# Altium schematic sheet Comunicaciones.SchDoc
size A4
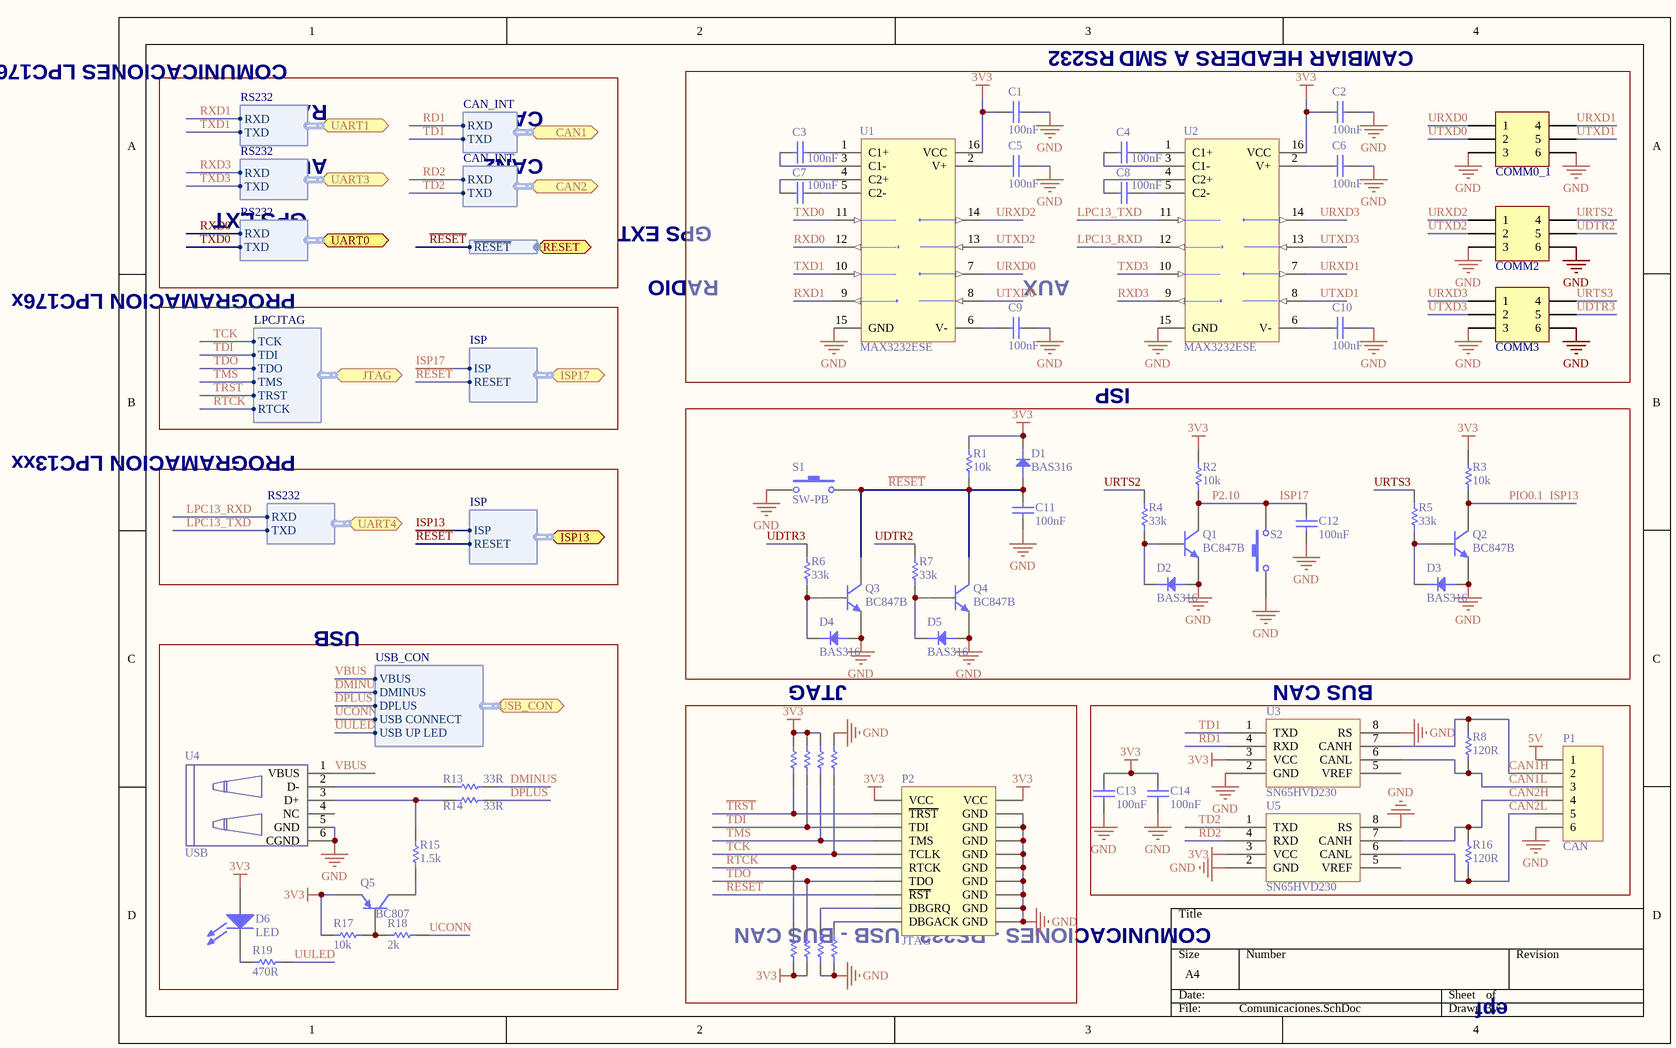
[diagram p0: Comunicaciones.SchDoc]

## Parts
C1  value 100nF  [CAP0402]  (hidden comment: Capacitor)
C2  value 100nF  [CAP0402]  (hidden comment: Capacitor)
C3  value 100nF  [CAP0402]  (hidden comment: Capacitor)
C4  value 100nF  [CAP0402]  (hidden comment: Capacitor)
C5  value 100nF  [CAP0402]  (hidden comment: Capacitor)
C6  value 100nF  [CAP0402]  (hidden comment: Capacitor)
C7  value 100nF  [CAP0402]  (hidden comment: Capacitor)
C8  value 100nF  [CAP0402]  (hidden comment: Capacitor)
C9  value 100nF  [CAP0402]  (hidden comment: Capacitor)
C10  value 100nF  [CAP0402]  (hidden comment: Capacitor)
C11  value 100nF  [CAP0402]  (hidden comment: Capacitor)
C12  value 100nF  [CAP0402]  (hidden comment: Capacitor)
C13  value 100nF  [CAP0402]  (hidden comment: Capacitor)
C14  value 100nF  [CAP0402]  (hidden comment: Capacitor)
COMM0_1  AP_COMM  [HDR2X3_CEN]  (value not drawn)
COMM2  AP_COMM  [HDR2X3_CEN]  (value not drawn)
COMM3  AP_COMM  [HDR2X3_CEN]  (value not drawn)
D1  BAS316  [SOD-323]
D2  BAS316  [SOD-323]
D3  BAS316  [SOD-323]
D4  BAS316  [SOD-323]
D5  BAS316  [SOD-323]
D6  LED  [PLCC-2Rojo]
P1  CAN  [HDR1X6]
P2  JTAG  [HDR2X10]
Q1  BC847B  [SOT23]
Q2  BC847B  [SOT23]
Q3  BC847B  [SOT23]
Q4  BC847B  [SOT23]
Q5  BC807  [SOT23]
R1  value 10k  [RES0402]  (hidden comment: Resistor)
R2  value 10k  [RES0402]  (hidden comment: Resistor)
R3  value 10k  [RES0402]  (hidden comment: Resistor)
R4  value 33k  [RES0402]  (hidden comment: Resistor)
R5  value 33k  [RES0402]  (hidden comment: Resistor)
R6  value 33k  [RES0402]  (hidden comment: Resistor)
R7  value 33k  [RES0402]  (hidden comment: Resistor)
R8  value 120R  [RES0402]  (hidden comment: Resistor)
R9  Resistor  [RES0402]  (value not drawn)
R10  Resistor  [RES0402]  (value not drawn)
R11  Resistor  [RES0402]  (value not drawn)
R12  Resistor  [RES0402]  (value not drawn)
R13  value 33R  [RES0402]  (hidden comment: Resistor)
R14  value 33R  [RES0402]  (hidden comment: Resistor)
R15  value 1.5k  [RES0402]  (hidden comment: Resistor)
R16  value 120R  [RES0402]  (hidden comment: Resistor)
R17  value 10k  [RES0402]  (hidden comment: Resistor)
R18  value 2k  [RES0402]  (hidden comment: Resistor)
R19  value 470R  [RES0402]  (hidden comment: Resistor)
R20  Resistor  [RES0402]  (value not drawn)
R21  Resistor  [RES0402]  (value not drawn)
R22  Resistor  [RES0402]  (value not drawn)
R23  Resistor  [RES0402]  (value not drawn)
S1  SW-PB  [SW-PB6mm - 2]
S2  SW-PB  [SW-PB6mm - 2]  (value not drawn)
U1  MAX3232ESE  [SOIC127P602-16BN]
U2  MAX3232ESE  [SOIC127P602-16BN]
U3  SN65HVD230  [SOIC127P600-8CN]
U4  USB  [USB/SM0.8-6H5]
U5  SN65HVD230  [SOIC127P600-8CN]

## Ports
CAN1 (harness CAN_INT), CAN2 (harness CAN_INT), ISP13 (harness ISP), ISP17 (harness ISP), JTAG (harness LPCJTAG), RESET (harness RESET), UART0 (harness RS232), UART1 (harness RS232), UART3 (harness RS232), UART4 (harness RS232), USB_CON (harness USB_CON)

## Harnesses
RS232: RXD, TXD
CAN_INT: RXD, TXD
LPCJTAG: TCK, TDI, TDO, TMS, TRST, RTCK
ISP: ISP, RESET
USB_CON: DMINUS, DPLUS, VBUS, USB CONNECT, USB UP LED
RESET: ~{RESET}

## Nets
3V3: C1.2 C2.2 C13.2 C14.2 D1.1(K) D6.1(A) P2.1(VCC) P2.2(VCC) Q5.2(E) R1.2 R2.2 R3.2 R9.1 R10.1 R11.1 R17.1 R20.2 R21.2 U1.16(VCC) U2.16(VCC) U3.3(VCC) U5.3(VCC)
5V: P1.1
GND: C1.1 C2.1 C5.1 C6.1 C9.1 C10.1 C11.2 C12.2 C13.1 C14.1 COMM0_1.3 COMM0_1.6 COMM2.3 COMM2.6 COMM3.3 COMM3.6 D2.2(A) D3.2(A) D4.2(A) D5.2(A) P1.6 P2.4(GND) P2.6(GND) P2.8(GND) P2.10(GND) P2.12(GND) P2.14(GND) P2.16(GND) P2.18(GND) P2.20(GND) Q1.2(E) Q2.2(E) Q3.2(E) Q4.2(E) R12.1 R22.2 R23.2 S1.1 S2.1 U1.15(GND) U2.15(GND) U3.2(GND) U3.8(RS) U4.5(GND) U4.6(CGND) U5.2(GND) U5.8(RS)
~{RESET}: C11.1 D1.2(A) P2.15(~{RST}) Q3.3(C) Q4.3(C) R1.1 S1.2 ; port ISP17.RESET, port ISP13.RESET, port RESET.~{RESET}
~{TRST}: P2.3(~{TRST}) R9.2 ; port JTAG.TRST
CAN1H: P1.2 R8.1 U3.7(CANH)
CAN1L: P1.3 R8.2 U3.6(CANL)
CAN2H: P1.4 R16.1 U5.7(CANH)
CAN2L: P1.5 R16.2 U5.6(CANL)
DMINUS: R13.2 ; port USB_CON.DMINUS
DPLUS: R14.2 ; port USB_CON.DPLUS
ISP13: Q2.3(C) R3.1 ; port ISP13.ISP  [also labelled PIO0.1]
ISP17: C12.1 Q1.3(C) R2.1 S2.2 ; port ISP17.ISP  [also labelled P2.10]
LPC13_RXD: U2.12(R1OUT) ; port UART4.RXD
LPC13_TXD: U2.11(T1IN) ; port UART4.TXD
RD1: U3.4(RXD) ; port CAN1.RXD
RD2: U5.4(RXD) ; port CAN2.RXD
RTCK: P2.11(RTCK) R20.1 ; port JTAG.RTCK
RXD0: U1.12(R1OUT) ; port UART0.RXD
RXD1: U1.9(R2OUT) ; port UART1.RXD
RXD3: U2.9(R2OUT) ; port UART3.RXD
TCK: P2.9(TCLK) R12.2 ; port JTAG.TCK
TD1: U3.1(TXD) ; port CAN1.TXD
TD2: U5.1(TXD) ; port CAN2.TXD
TDI: P2.5(TDI) R10.2 ; port JTAG.TDI
TDO: P2.13(TDO) R21.1 ; port JTAG.TDO
TMS: P2.7(TMS) R11.2 ; port JTAG.TMS
TXD0: U1.11(T1IN) ; port UART0.TXD
TXD1: U1.10(T2IN) ; port UART1.TXD
TXD3: U2.10(T2IN) ; port UART3.TXD
UCONN: R18.2 ; port USB_CON.USB CONNECT
UDTR2: COMM2.5 R7.2
UDTR3: COMM3.5 R6.2
URTS2: COMM2.4 R4.2
URTS3: COMM3.4 R5.2
URXD0: COMM0_1.1 U1.7(T2OUT)
URXD1: COMM0_1.4 U2.7(T2OUT)
URXD2: COMM2.1 U1.14(T1OUT)
URXD3: COMM3.1 U2.14(T1OUT)
UTXD0: COMM0_1.2 U1.8(R2IN)
UTXD1: COMM0_1.5 U2.8(R2IN)
UTXD2: COMM2.2 U1.13(R1IN)
UTXD3: COMM3.2 U2.13(R1IN)
UULED: R19.2 ; port USB_CON.USB UP LED
VBUS: U4.1(VBUS) ; port USB_CON.VBUS
NetC3_1: C3.1 U1.1(C1+)
NetC3_2: C3.2 U1.3(C1-)
NetC4_1: C4.1 U2.1(C1+)
NetC4_2: C4.2 U2.3(C1-)
NetC5_2: C5.2 U1.2(V+)
NetC6_2: C6.2 U2.2(V+)
NetC7_1: C7.1 U1.5(C2-)
NetC7_2: C7.2 U1.4(C2+)
NetC8_1: C8.1 U2.5(C2-)
NetC8_2: C8.2 U2.4(C2+)
NetC9_2: C9.2 U1.6(V-)
NetC10_2: C10.2 U2.6(V-)
NetD2_1: D2.1(K) Q1.1(B) R4.1
NetD3_1: D3.1(K) Q2.1(B) R5.1
NetD4_1: D4.1(K) Q3.1(B) R6.1
NetD5_1: D5.1(K) Q4.1(B) R7.1
NetD6_2: D6.2(K) R19.1
NetP2_17: P2.17(DBGRQ) R22.1
NetP2_19: P2.19(DBGACK) R23.1
NetQ5_1: Q5.1(B) R17.2 R18.1
NetQ5_3: Q5.3(C) R15.2
NetR13_1: R13.1 U4.2(D-)
NetR14_1: R14.1 R15.1 U4.3(D+)

Not connected (* = marked no-connect by the designer): U3 5(VREF); U4 4(NC); U5 5(VREF)

## Notes on the sheet
- COMUNICACIONES LPC176x
- RS232
- CAMBIAR HEADERS A SMD
- RADIO
- CAN1
- AUX
- CAN2
- GPS EXT
- (near C7) GPS EXT
- PROGRAMACION LPC176x
- ISP
- PROGRAMACION LPC13xx
- USB
- JTAG
- BUS CAN
- COMUNICACIONES - RS232 - USB - BUS CAN
- epf

## Library data of the parts
C1-C14 = Cap
COMM0_1 COMM2 COMM3 = AP_COMM: Header, 3-Pin, Dual row; LatestRevisionDate: 17-Jul-2002; LatestRevisionNote: Re-released for DXP Platform.; Publisher: Altium Limited
D6 = LED1
P1 = CAN_Conn: Header, 6-Pin; LatestRevisionDate: 17-Jul-2002; LatestRevisionNote: Re-released for DXP Platform.; Publisher: Altium Limited
P2 = JTAG: Header, 10-Pin, Dual row; LatestRevisionDate: 17-Jul-2002; LatestRevisionNote: Re-released for DXP Platform.; Publisher: Altium Limited
Q1-Q4 = BC847B: NPN 100MHz
Q5 = BC807: PNP 100MHz
R1-R8 R13-R19 = Res
R9-R12 R20-R23 = Res: Value: 10k
S1 S2 = SW-PB: Switch; Published: 24-Mar-1999; LatestRevisionDate: 17-Jul-2002; LatestRevisionNote: Re-released for DXP Platform.; PackageReference: SPST-2; Publisher: Altium Limited
U1 U2 = MAX3232ESE+
U3 U5 = SN65HVD230: 3.3-V CAN TRANSCEIVERS
U4 = USB-miniB